# Altium project Wireless_Controller_V1.1.PrjPcb
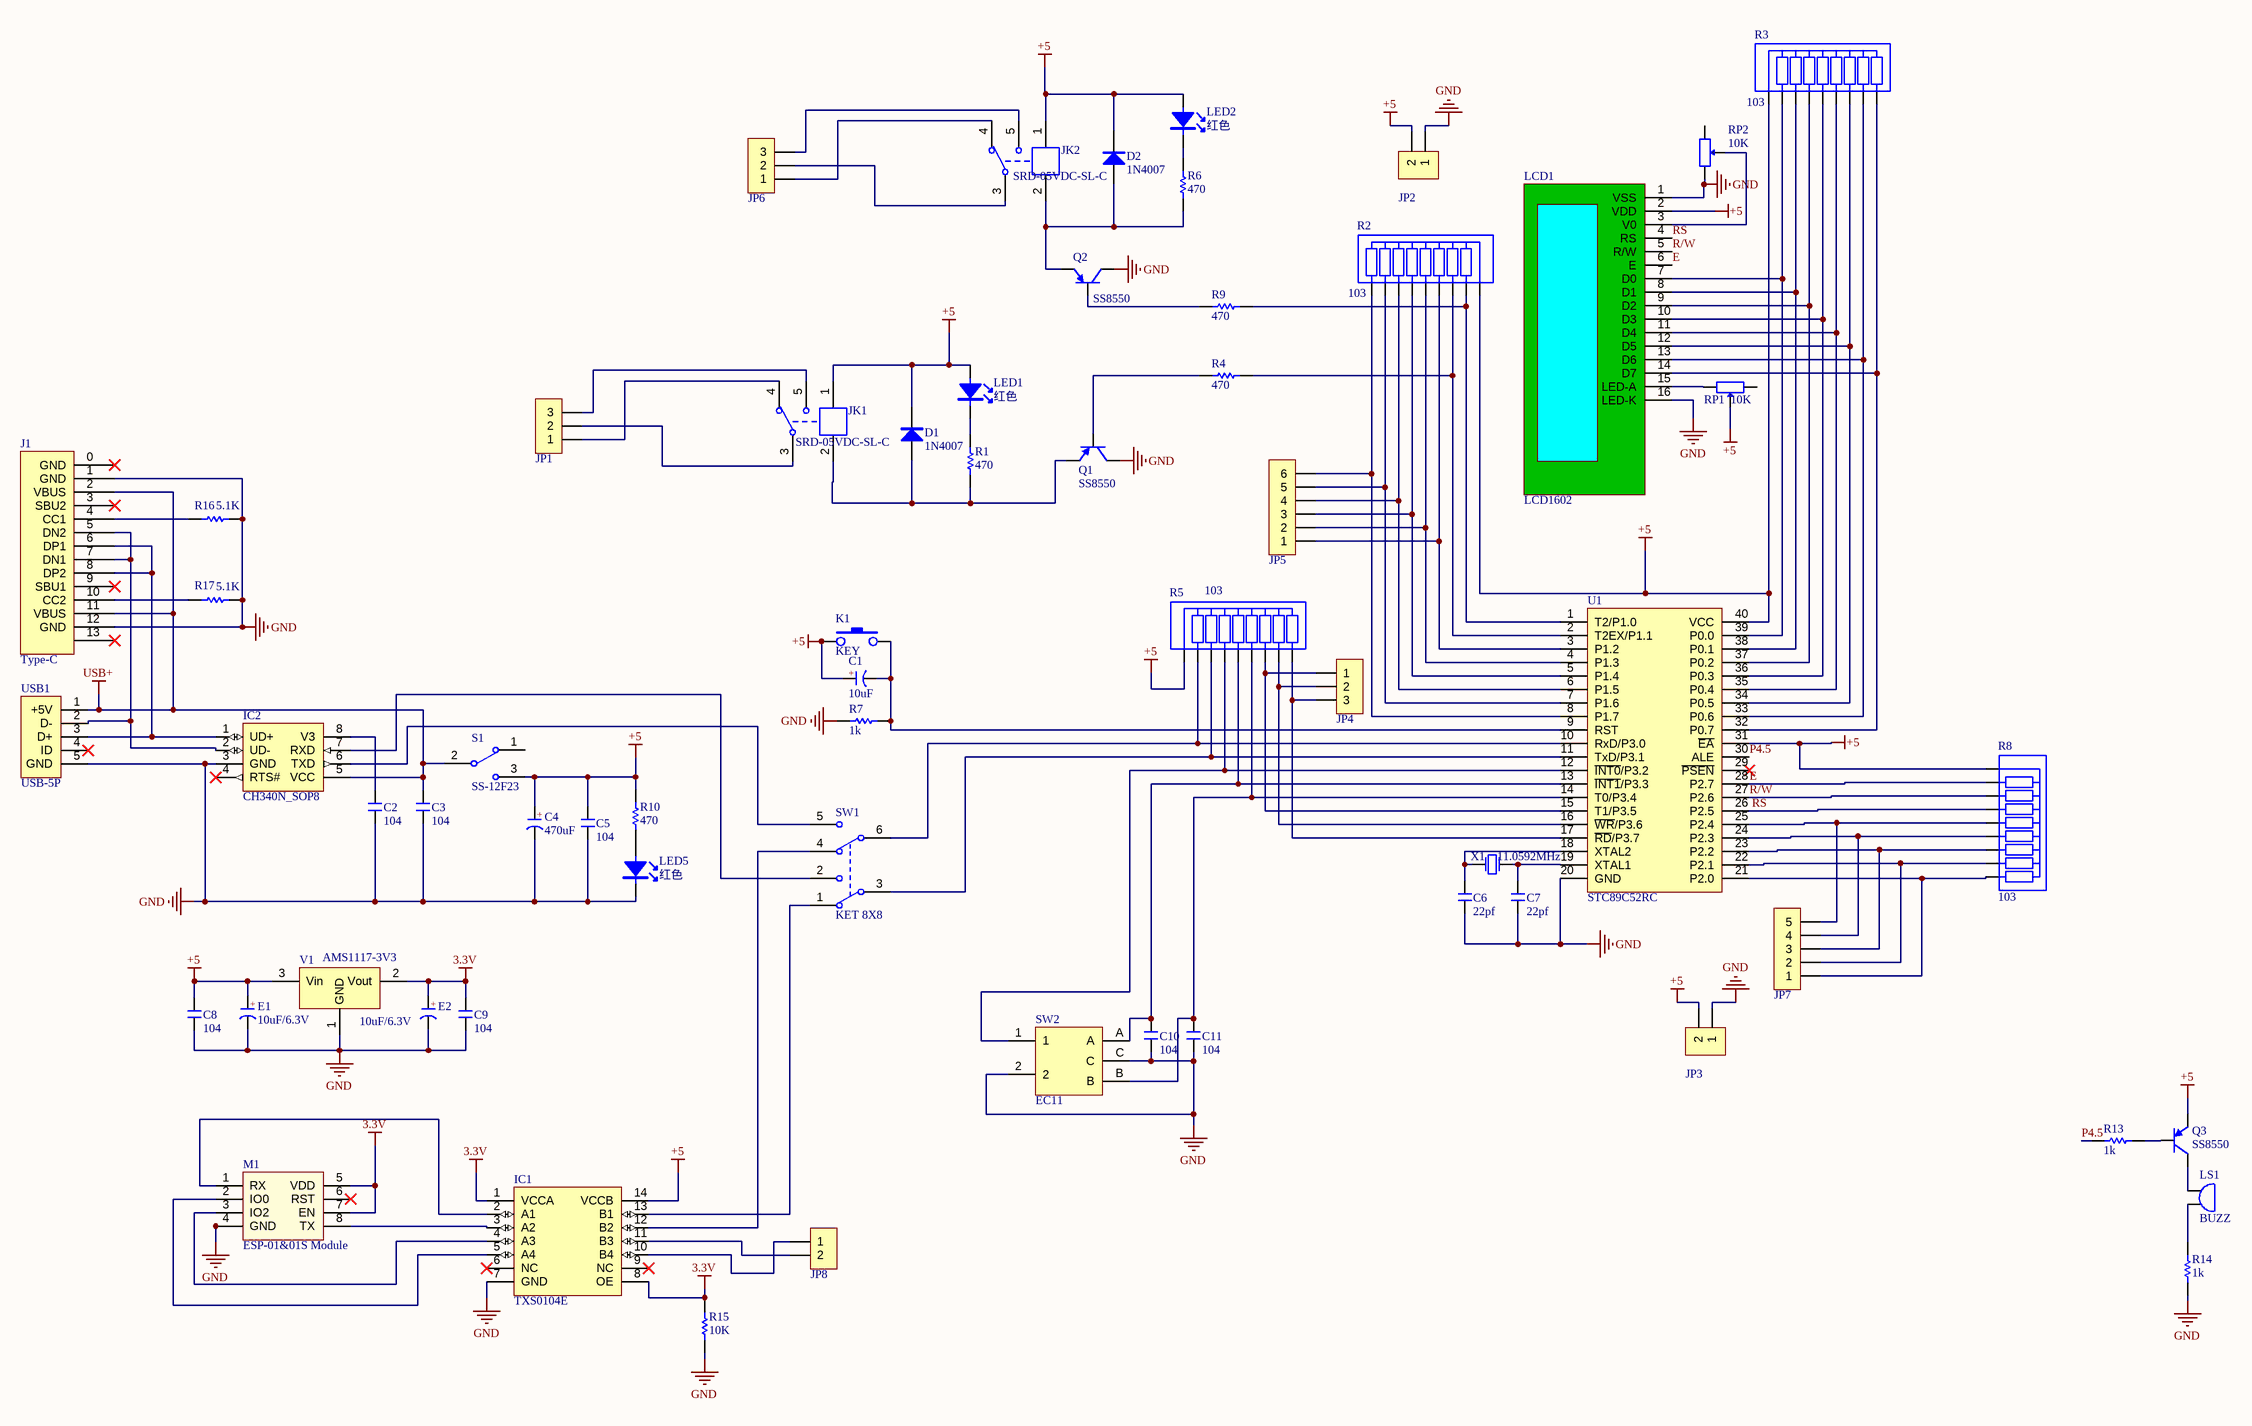
[diagram p0: Wireless_Controller_V1.1.SchDoc]
1 sheet, 62 parts. Net scope: global (net labels, ports and power ports of the same name join across sheets).
Board file: Wireless_Controller_V1.1.PcbDoc

## Sheet Wireless_Controller_V1.1.SchDoc
size A2

### Parts
C1  10uF  [CAP 1.5*4*8]
C2  104  [CC 1.8*3.6]
C3  104  [CC 1.8*3.6]
C4  470uF  [CAP 2.5*6.3*11.2 - BK]
C5  104  [CC 1.8*3.6]
C6  22pf  [CC 1.8*3.6]
C7  22pf  [CC 1.8*3.6]
C8  104  [CC 1.8*3.6]
C9  104  [CC 1.8*3.6]
C10  104  [CC 1.8*3.6]
C11  104  [CC 1.8*3.6]
D1  1N4007  [DO-41]
D2  1N4007  [DO-41]
E1  10uF/6.3V  [CD S(2012)]
E2  10uF/6.3V  [CD S(2012)]
IC1  TXS0104E  [TSSOP14_L]
IC2  CH340N_SOP8  [SOP8]
J1  Type-C  [Type-C_16pin]
JK1  SRD-05VDC-SL-C  [SRD-C_B]
JK2  SRD-05VDC-SL-C  [SRD-C_B]
JP1  HDR-1X3  [KF7620-3P]  (value not drawn)
JP2  HDR-1X2  [KF7620-2P]  (value not drawn)
JP3  HDR-1X2  [KF7620-2P]  (value not drawn)
JP4  HDR-1X3  [KF301-5.0-3P]  (value not drawn)
JP5  HDR-1X6  [KF301-5.0-6P]  (value not drawn)
JP6  HDR-1X3  [KF7620-3P]  (value not drawn)
JP7  HDR-1X5  [KF301-5.0-5P]  (value not drawn)
JP8  HDR-1X2  [KF301-5.0-2P]  (value not drawn)
K1  KEY  [TSW DIP-6*6*5]
LCD1  LCD1602  [LCD-1602]
LED1  红色  [LED 3MM-R]
LED2  红色  [LED 3MM-R]
LED5  红色  [LED 3MM-R]
LS1  BUZZ  [BEEP 6.5x12x8.5]
M1  ESP-01&01S Module  [ESP-01&01S Module]
Q1  SS8550  [TO92A]
Q2  SS8550  [TO92A]
Q3  SS8550  [TO92A]
R1  470  [RS 1/4W]
R2  103  [R SIP9-2.54]
R3  103  [R SIP9-2.54]
R4  470  [RS 1/4W]
R5  103  [R SIP9-2.54]
R6  470  [RS 1/4W]
R7  1k  [RS 1/4W]
R8  103  [R SIP9-2.54]
R9  470  [RS 1/4W]
R10  470  [RS 1/4W]
R13  1k  [RS 1/4W]
R14  1k  [RS 1/4W]
R15  10K  [RS 1/4W]
R16  5.1K  [RS 1/4W]
R17  5.1K  [RS 1/4W]
RP1  10K  [3296W]
RP2  10K  [3296W]
S1  SS-12F23  [SS-12D10]
SW1  KET 8X8  [KFT DIP-8X8]
SW2  EC11  [EC11]
U1  STC89C52RC  [DIP40-600]
USB1  USB-5P  [USB-MICRO_A]
V1  AMS1117-3V3  [SOT223_L]
X1  11.0592MHz  [OSC HC-49S]

### Nets
3.3V: C9.2 E2.1(A) IC1.1(VCCA) IC1.8(OE) M1.5(VDD) M1.7(EN) R15.2 V1.2(Vout)
+5: C1.1(A) C4.1(A) C5.2 C8.2 D1.2(K) D2.2(K) E1.1(A) IC1.14(VCCB) JK1.1 JK2.1 JP2.2 JP3.2 K1.1 LCD1.2(VDD) LED1.1(A) LED2.1(A) Q3.1(E) R2.1 R3.1 R5.1 R8.1 R10.2 RP1.2 S1.3 U1.31(~{EA}) U1.40(VCC) V1.3(Vin)
GND: C2.1 C3.1 C4.2(K) C5.1 C6.1 C7.1 C8.1 C9.1 C10.1 C11.1 E1.2(K) E2.2(K) IC1.7(GND) IC2.3(GND) J1.1(GND) J1.12(GND) JP2.1 JP3.1 LCD1.1(VSS) LCD1.16(LED-K) LED5.2(K) M1.4(GND) Q1.3(C) Q2.3(C) R7.2 R14.2 R15.1 R16.2 R17.2 RP2.3 SW2.2 SW2.C U1.20(GND) USB1.5(GND) V1.1(GND)
USB+: C3.2 IC2.5(VCC) J1.2(VBUS) J1.11(VBUS) S1.2 USB1.1(+5V)
E: LCD1.6(E) R8.2 U1.28(P2.7)
P4.5: R13.2 U1.30(ALE)
R/W: LCD1.5(R/W) R8.3 U1.27(P2.6)
RS: LCD1.4(RS) R8.4 U1.26(P2.5)
NetC1_2: C1.2(K) K1.2 R7.1 U1.9(RST)
NetC2_2: C2.2 IC2.8(V3)
NetC6_2: C6.2 U1.18(XTAL2) X1.1
NetC7_2: C7.2 U1.19(XTAL1) X1.2
NetC10_2: C10.2 R5.5 SW2.A U1.13(~{INT1}/P3.3)
NetC11_2: C11.2 R5.6 SW2.B U1.14(T0/P3.4)
NetD1_1: D1.1(A) JK1.2 Q1.1(E) R1.2
NetD2_1: D2.1(A) JK2.2 Q2.1(E) R6.2
NetIC1_2: IC1.2(A1) M1.1(RX)
NetIC1_3: IC1.3(A2) M1.8(TX)
NetIC1_4: IC1.4(A3) M1.3(IO2)
NetIC1_5: IC1.5(A4) M1.2(IO0)
NetIC1_10: IC1.10(B4) JP8.1
NetIC1_11: IC1.11(B3) JP8.2
NetIC1_12: IC1.12(B2) SW1.4(NO2)
NetIC1_13: IC1.13(B1) SW1.1(NC1)
NetIC2_1: IC2.1(UD+) J1.6(DP1) J1.8(DP2) USB1.3(D+)
NetIC2_2: IC2.2(UD-) J1.5(DN2) J1.7(DN1) USB1.2(D-)
NetIC2_6: IC2.6(TXD) SW1.5(COM2)
NetIC2_7: IC2.7(RXD) SW1.2(COM2)
NetJ1_4: J1.4(CC1) R16.1
NetJ1_10: J1.10(CC2) R17.1
NetJK1_3: JK1.3 JP1.2
NetJK1_4: JK1.4 JP1.1
NetJK1_5: JK1.5 JP1.3
NetJK2_3: JK2.3 JP6.2
NetJK2_4: JK2.4 JP6.1
NetJK2_5: JK2.5 JP6.3
NetJP4_1: JP4.1 R5.7 U1.15(T1/P3.5)
NetJP4_2: JP4.2 R5.8 U1.16(~{WR}/P3.6)
NetJP4_3: JP4.3 R5.9 U1.17(~{RD}/P3.7)
NetJP5_1: JP5.1 R2.4 U1.3(P1.2)
NetJP5_2: JP5.2 R2.5 U1.4(P1.3)
NetJP5_3: JP5.3 R2.6 U1.5(P1.4)
NetJP5_4: JP5.4 R2.7 U1.6(P1.5)
NetJP5_5: JP5.5 R2.8 U1.7(P1.6)
NetJP5_6: JP5.6 R2.9 U1.8(P1.7)
NetJP7_1: JP7.1 R8.9 U1.21(P2.0)
NetJP7_2: JP7.2 R8.8 U1.22(P2.1)
NetJP7_3: JP7.3 R8.7 U1.23(P2.2)
NetJP7_4: JP7.4 R8.6 U1.24(P2.3)
NetJP7_5: JP7.5 R8.5 U1.25(P2.4)
NetLCD1_3: LCD1.3(V0) RP2.2
NetLCD1_7: LCD1.7(D0) R3.2 U1.39(P0.0)
NetLCD1_8: LCD1.8(D1) R3.3 U1.38(P0.1)
NetLCD1_9: LCD1.9(D2) R3.4 U1.37(P0.2)
NetLCD1_10: LCD1.10(D3) R3.5 U1.36(P0.3)
NetLCD1_11: LCD1.11(D4) R3.6 U1.35(P0.4)
NetLCD1_12: LCD1.12(D5) R3.7 U1.34(P0.5)
NetLCD1_13: LCD1.13(D6) R3.8 U1.33(P0.6)
NetLCD1_14: LCD1.14(D7) R3.9 U1.32(P0.7)
NetLCD1_15: LCD1.15(LED-A) RP1.3
NetLED1_2: LED1.2(K) R1.1
NetLED2_2: LED2.2(K) R6.1
NetLED5_1: LED5.1(A) R10.1
NetLS1_1: LS1.1 Q3.3(C)
NetLS1_2: LS1.2 R14.1
NetQ1_2: Q1.2(B) R4.1
NetQ2_2: Q2.2(B) R9.1
NetQ3_2: Q3.2(B) R13.1
NetR2_2: R2.2 R9.2 U1.1(T2/P1.0)
NetR2_3: R2.3 R4.2 U1.2(T2EX/P1.1)
NetR5_2: R5.2 SW1.6(NC2) U1.10(RxD/P3.0)
NetR5_3: R5.3 SW1.3(NO1) U1.11(TxD/P3.1)
NetR5_4: R5.4 SW2.1 U1.12(~{INT0}/P3.2)

Not connected (* = marked no-connect by the designer): IC1 6(NC)* 9(NC)*; IC2 4(RTS#)*; J1 0(GND)* 3(SBU2)* 9(SBU1)* 13*; M1 6(RST)*; RP1 1; RP2 1; S1 1; U1 29(~{PSEN})*; USB1 4(ID)*

### Notes on the sheet
- THIS DOCUMENT AND THE DATA DISCLOSED HEREIN OR
- HEREWITH IS THE PROPERTY OF ALTIUM LIMITED AND MAY
- DWG NO:
- REVISION
- REV:
- DESCRIPTION
- DATE
- APPROVED
- BE FREELY DISTRIBUTED IN WHOLE. NO RIGHTS ARE
- RESERVED OR EXPRESS OR IMPLIED WARANTEE GIVEN.
- ENG:
- APPROVALS
- PROJECT
- DSN:
- CHK:
- REFERENCE DOCUMENTS
- PROJECT REVISION:
- TITLE
- DOCUMENT REVISION:
- DESIGN ITEM:
- BOM:
- FAB DWG:
- PCB DWG:
- ASSY DWG:
- SCALE:
- A3
- SIZE
- CAGE CODE
- FILE NAME
- DWG NO.
- SHEET
- OF
- REV
- (in symbol CE) +
- (in symbol CT) +

### Library data of the parts
C1 C4 = CE: 直插电解电容; 淘宝ID: 小糖豆的小窝窝; BOM名称: 直插电解电容; 下单链接: https://item.taobao.com/item.htm?ft=t&id=613637044352
C2 C3 C5-C11 = CC: 瓷片电容; 淘宝ID: 小糖豆的小窝窝; BOM名称: 瓷片电容; 下单链接: https://item.taobao.com/item.htm?ft=t&id=613637044352
D1 D2 = 1N4007: 整流二极管; 淘宝ID: 小糖豆的小窝窝; BOM名称: 整流二极管; 下单链接: https://item.taobao.com/item.htm?ft=t&id=613637044352
E1 E2 = CT: 贴片钽电容; 淘宝ID: 小糖豆的小窝窝; BOM名称: 贴片钽电容; 下单链接: https://item.taobao.com/item.htm?ft=t&id=613637044352
IC1 = TXS0104E: TXS0104E_TSSOP(14pin)
IC2 = CH340N_SOP8: USB转串口芯片
J1 = Type-C_16pin
JK1 JK2 = SRD-05VDC-SL-C: 继电器  5V一组转换; 淘宝ID: 小糖豆的小窝窝; BOM名称: 继电器  5V一组转换; 下单链接: https://item.taobao.com/item.htm?ft=t&id=613637044352
JP1 JP4 JP6 = Header 3: 3P接插件; 淘宝ID: 小糖豆的小窝窝; BOM名称: 3P接插件; 下单链接: https://item.taobao.com/item.htm?ft=t&id=613637044352
JP2 JP3 JP8 = Header 2: 2P接插件; 淘宝ID: 小糖豆的小窝窝; BOM名称: 2P接插件; 下单链接: https://item.taobao.com/item.htm?ft=t&id=613637044352
JP5 = Header 6: 6P接插件; 淘宝ID: 小糖豆的小窝窝; BOM名称: 6P接插件; 下单链接: https://item.taobao.com/item.htm?ft=t&id=613637044352
JP7 = Header 5: 5P接插件; 淘宝ID: 小糖豆的小窝窝; BOM名称: 5P接插件; 下单链接: https://item.taobao.com/item.htm?ft=t&id=613637044352
K1 = KEY: 四角直插开关; 淘宝ID: 小糖豆的小窝窝; BOM名称: 四角直插开关; 下单链接: https://item.taobao.com/item.htm?ft=t&id=613637044352
LCD1 = LCD1602: 淘宝ID: 小糖豆的小窝窝; BOM名称: LCD 1602; 下单链接: https://item.taobao.com/item.htm?ft=t&id=613637044352
LED1 LED2 LED5 = LED-3MM: 插件LED; 淘宝ID: 小糖豆的小窝窝; BOM名称: 插件LED; 下单链接: https://item.taobao.com/item.htm?ft=t&id=613637044352
LS1 = BUZZ: 蜂鸣器; 淘宝ID: 小糖豆的小窝窝; BOM名称: 蜂鸣器; 下单链接: https://item.taobao.com/item.htm?ft=t&id=613637044352
Q1-Q3 = 8550-DIP: 高频放大-PNP型; BOM名称: 高频放大-PNP型; 下单链接: https://item.taobao.com/item.htm?ft=t&id=613637044352
R1 R4 R6 R7 R9 R10 R13-R17 = Res: 色环电阻; 淘宝ID: 小糖豆的小窝窝; BOM名称: 色环电阻; 下单链接: https://item.taobao.com/item.htm?ft=t&id=613637044352
R2 R3 R5 R8 = R SIP9: 9脚直插排阻; 淘宝ID: 小糖豆的小窝窝; BOM名称: 9脚直插排阻; 下单链接: https://item.taobao.com/item.htm?ft=t&id=613637044352
RP1 RP2 = RP: 单联电位器; 淘宝ID: 小糖豆的小窝窝; BOM名称: 单联电位器; 下单链接: https://item.taobao.com/item.htm?ft=t&id=613637044352
S1 = SSW-1P: 1路波动开关; 淘宝ID: 小糖豆的小窝窝; BOM名称: 1路波动开关; 下单链接: https://item.taobao.com/item.htm?ft=t&id=613637044352
SW1 = KET 8X8: 8*8自锁开关; 淘宝ID: 小糖豆的小窝窝; BOM名称: 8*8自锁开关; 下单链接: https://item.taobao.com/item.htm?ft=t&id=613637044352
SW2 = SW-EC11: 数字开关编码器; 淘宝ID: 小糖豆的小窝窝; BOM名称: 数字开关编码器; 下单链接: https://item.taobao.com/item.htm?ft=t&id=613637044352
U1 = STC89C52RC: STC单片机; 淘宝ID: 小糖豆的小窝窝; BOM名称: STC单片机; Alias1: https://item.taobao.com/item.htm?ft=t&id=613637044352
USB1 = USB-5P: 微型USB母座; 淘宝ID: 小糖豆的小窝窝; BOM名称: 微型USB母座; 下单链接: https://item.taobao.com/item.htm?ft=t&id=613637044352
V1 = AMS1117: 三端稳压芯片; 淘宝ID: 小糖豆的小窝窝; BOM名称: 三端稳压芯片; 下单链接: https://item.taobao.com/item.htm?ft=t&id=613637044352
X1 = XTAL-2P: 2脚无源脚晶振; 淘宝ID: 小糖豆的小窝窝; BOM名称: 2脚无源脚晶振; 下单链接: https://item.taobao.com/item.htm?ft=t&id=613637044352